# EAGLE schematic batsense (EAGLE 4.13)
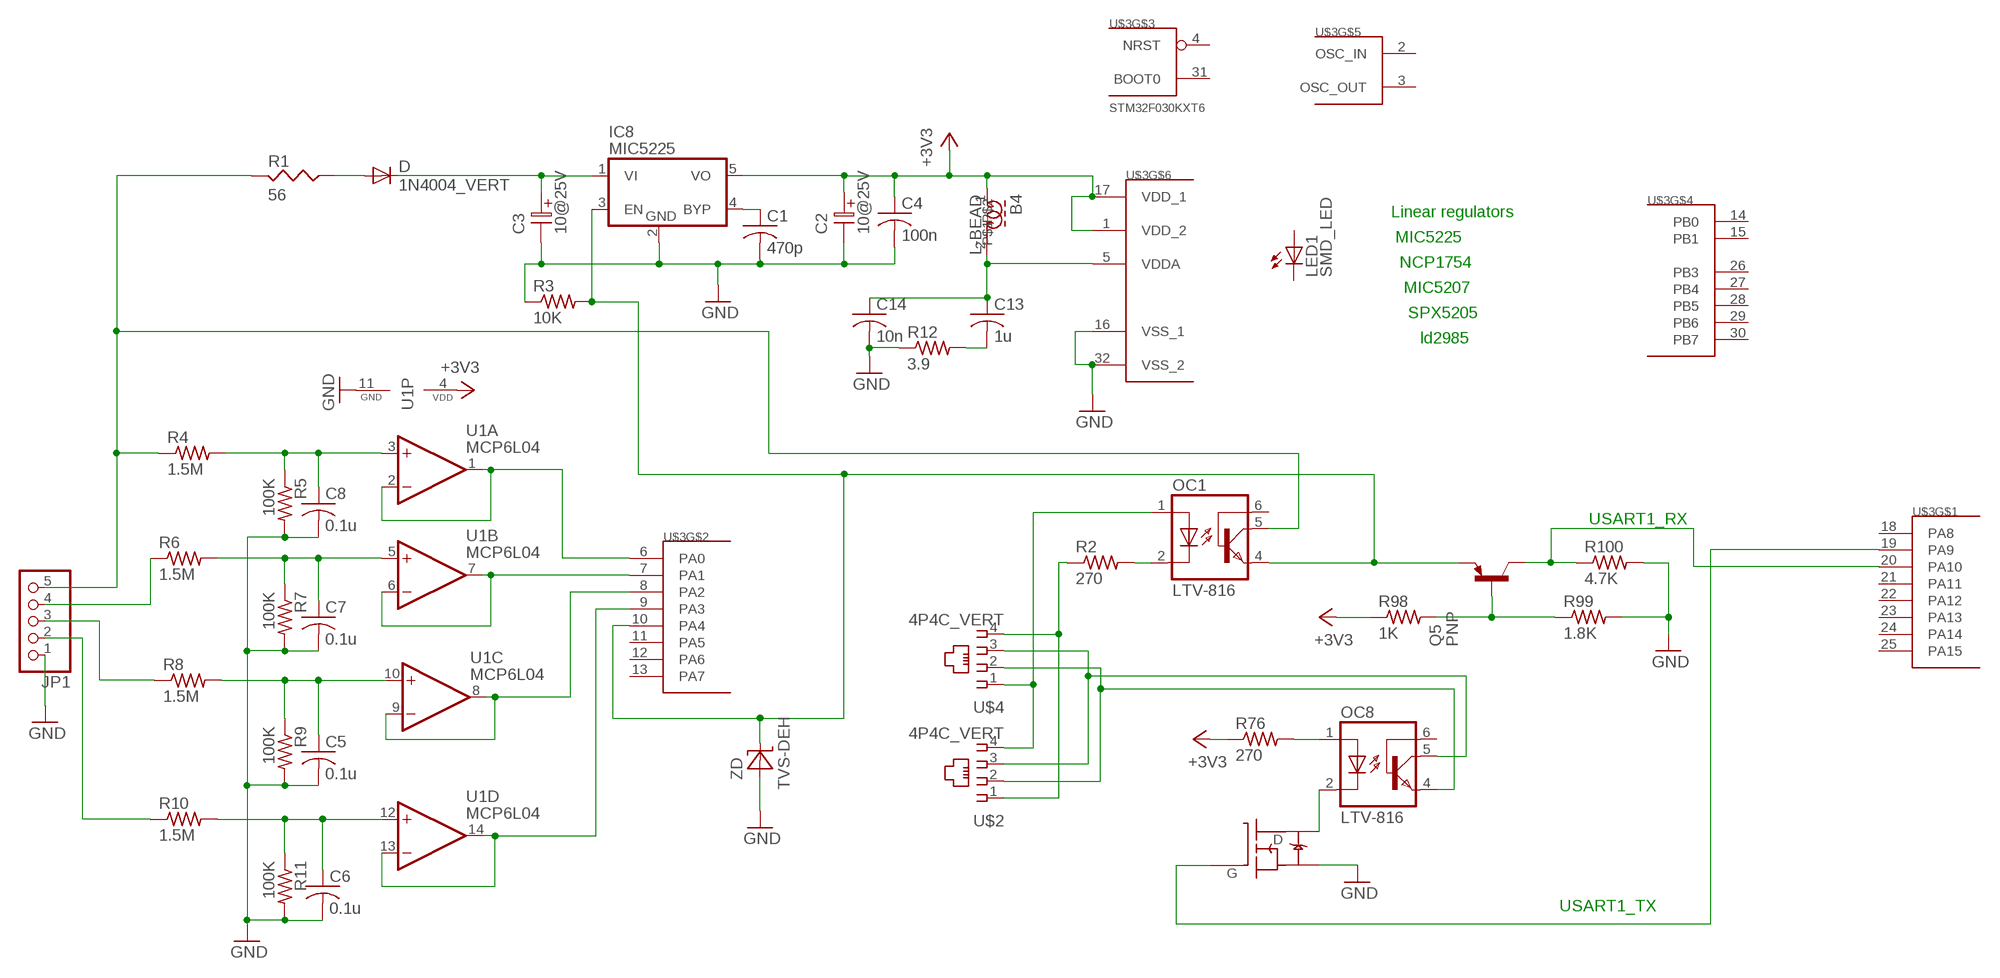
[diagram p0: schematic, sheet 1]

## Parts
B4  L-BEAD  [C0805]
C1  470p  C-USC0603  [C0603]
C2  10@25V  ELC-2,5L  [ES-2,5L]
C3  10@25V  ELC-2,5L  [ES-2,5L]
C4  100n  C-USC0603  [C0603]
C5  0.1u  C-USC0603  [C0603]
C6  0.1u  C-USC0603  [C0603]
C7  0.1u  C-USC0603  [C0603]
C8  0.1u  C-USC0603  [C0603]
C13  1u  C-USC0603  [C0603]
C14  10n  C-USC0603  [C0603]
D  1N4004_VERT  [DO41-10_VERT]
IC8  MIC5225  MIC5205  [SOT-25]
JP1  PINHD-1X5  [1X05]
LED1  SMD_LED  [SMD_LED]
OC1  LTV-816  4N35  [DIL06]
OC8  LTV-816  4N35  [DIL06]
Q5  PNP  MMBTH81LT1SMD  [SOT23-BEC]
Q14  IRLML2060  [SOT-23]
R1  56  RESUS-S2,5  [RS-2,5]
R2  270  R-US_R0603  [R0603]
R3  10K  R-US_R0603  [R0603]
R4  1.5M  R-US_R0603  [R0603]
R5  100K  R-US_R0603  [R0603]
R6  1.5M  R-US_R0603  [R0603]
R7  100K  R-US_R0603  [R0603]
R8  1.5M  R-US_R0603  [R0603]
R9  100K  R-US_R0603  [R0603]
R10  1.5M  R-US_R0603  [R0603]
R11  100K  R-US_R0603  [R0603]
R12  3.9  R-US_R0603  [R0603]
R76  270  R-US_R0603  [R0603]
R98  1K  R-US_R0603  [R0603]
R99  1.8K  R-US_R0603  [R0603]
R100  4.7K  R-US_R0603  [R0603]
U1  MCP6L04  TLC084T  [TSSOP14]
U$2  4P4C_VERT  [MOD4P4C_VERT]
U$3  STM32F030KXT6  [TQFP32]
U$4  4P4C_VERT  [MOD4P4C_VERT]
ZD  TVS-DEH  [TVS-DEH]

## Nets
4WIRE_PLUS: OC8.5(COL) U$2.3 U$4.3
4WIRE_RCV: OC1.1(A) R2.1 U$2.1 U$2.4 U$4.1 U$4.4
4WIRE_XMIT: OC8.4(EMI) U$2.2 U$4.2
9_USART1_TX: Q14.1(G) U$3.19(PA9)
+3V3: B4.1 C2.1 C4.1 IC8.5(VO) R76.1 R98.1 U1.4(P:VDD) U$3.1(VDD_2) U$3.17(VDD_1)
+12V_RESISTORED: D.A R1.1
BATT_12V: JP1.5 OC1.5(COL) R1.2 R4.1
BATT_12V_X: JP1.4 R6.1
BATT_24V: JP1.3 R8.1
BATT_24V_X: JP1.2 R10.1
BATT_DIODE_+: C3.1 D.C IC8.1(VI)
DIVIDER_12: C8.1 R4.2 R5.1 U1.3(A:+IN)
DIVIDER_12X: C7.1 R6.2 R7.1 U1.5(B:+IN)
DIVIDER_24: C5.1 R8.2 R9.1 U1.10(C:+IN)
DIVIDER_24X: C6.1 R10.2 R11.1 U1.12(D:+IN)
FET_XMIT: OC8.2(C) Q14.3(D)
GND: C1.2 C2.2 C3.2 C4.2 C5.2 C6.2 C7.2 C8.2 C14.2 IC8.2(GND) JP1.1 Q14.2(S) R3.1 R5.2 R7.2 R9.2 R11.2 R12.1 R99.2 R100.2 U1.11(P:GND) U$3.16(VSS_1) U$3.32(VSS_2) ZD.A
N$3: C1.1 IC8.4(BYP)
N$4: OC1.2(C) R2.2
PA0: U1.1(A:OUT) U1.2(A:-IN) U$3.6(PA0)
PA1: U1.6(B:-IN) U1.7(B:OUT) U$3.7(PA1)
PA2: U1.8(C:OUT) U1.9(C:-IN) U$3.8(PA2)
PA3: U1.13(D:-IN) U1.14(D:OUT) U$3.9(PA3)
PA4_EN: IC8.3(EN) OC1.4(EMI) Q5.E R3.2 U$3.10(PA4) ZD.C
PA10_USART1_RX: Q5.C R100.1 U$3.20(PA10)
PNP_BASE: Q5.B R98.2 R99.1
VDDA: B4.2 C13.1 C14.1 U$3.5(VDDA)
VDDA_DAMP: C13.2 R12.2
XMIT_R: OC8.1(A) R76.2
Unconnected: LED1.A LED1.C OC1.6(BAS) OC8.6(BAS) U$3.2(OSC_IN) U$3.3(OSC_OUT) U$3.4(NRST) U$3.11(PA5) U$3.12(PA6) U$3.13(PA7) U$3.14(PB0) U$3.15(PB1) U$3.18(PA8) U$3.21(PA11) U$3.22(PA12) U$3.23(PA13) U$3.24(PA14) U$3.25(PA15) U$3.26(PB3) U$3.27(PB4) U$3.28(PB5) U$3.29(PB6) U$3.30(PB7) U$3.31(BOOT0)

## Notes on the sheet
- Linear regulators
- MIC5225
- NCP1754
- MIC5207
- SPX5205
- ld2985
- USART1_RX
- USART1_TX

## Library data of the parts
B4 = rcl:L-BEAD
C1 C4-C8 C13 C14 = rcl:C-US: CAPACITOR, American symbol
C2 C3 = DEH:ELC-2,5L
D = diode:1N4004_VERT
IC8 = linear:MIC5205
JP1 = pinhead:PINHD-1X5: PIN HEADER
LED1 = led:SMD_LED
OC1 OC8 = optocoupler:4N35: MOTOROLA OPTO COUPLER
Q5 = transistor-pnp:MMBTH81*: PNP Transistror
Q14 = transistor-fet:IRLML2060
R1 = DEH:RESUS-S2,5
R2-R12 R76 R98-R100 = rcl:R-US_: RESISTOR, American symbol
U1 = op-amp:TLC084: BiMOS OP-AMP Single Supply
U$2 U$4 = DEH:4P4C_VERT
U$3 = stm32:STM32F030KXT6
ZD = diode-1:TVS-DEH